# Altium schematic sheet Choin_led1_0.SchDoc
size A4; DocumentNumber: 2; SheetNumber: 2; SheetTotal: 4; LotOfPieces: 1
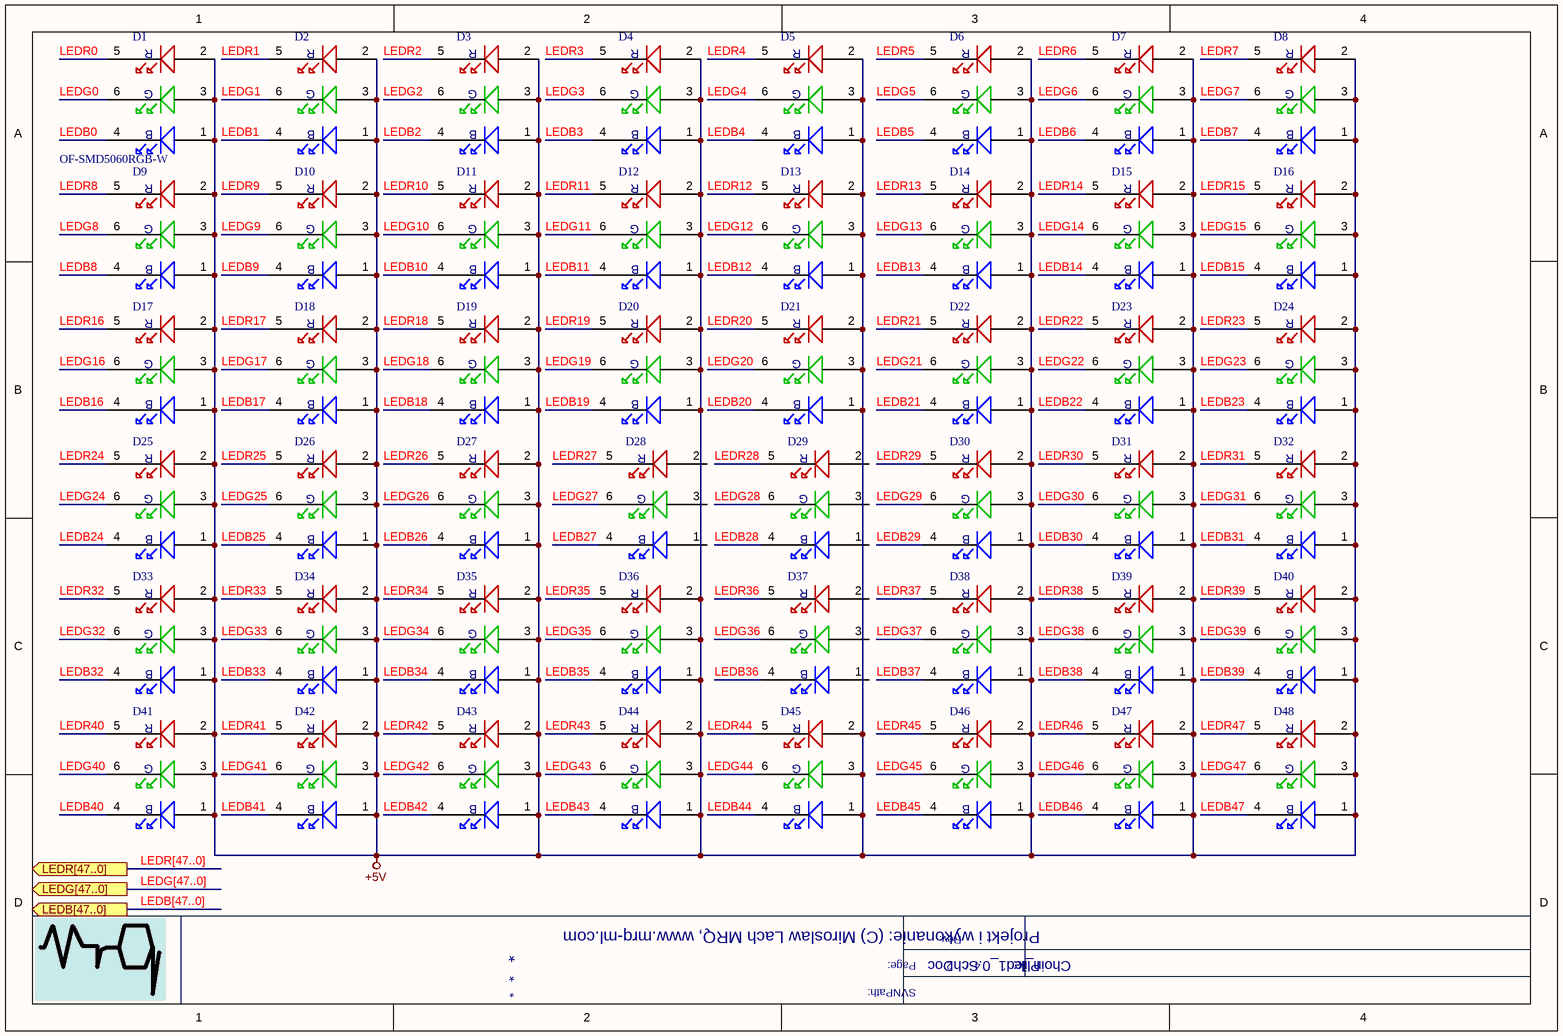
[diagram p0: Choin_led1_0.SchDoc]

## Parts
D1  OF-SMD5060RGB-W  [OF-SMD5060RGB-W]
D2  OF-SMD5060RGB-W  [OF-SMD5060RGB-W]  (value not drawn)
D3  OF-SMD5060RGB-W  [OF-SMD5060RGB-W]  (value not drawn)
D4  OF-SMD5060RGB-W  [OF-SMD5060RGB-W]  (value not drawn)
D5  OF-SMD5060RGB-W  [OF-SMD5060RGB-W]  (value not drawn)
D6  OF-SMD5060RGB-W  [OF-SMD5060RGB-W]  (value not drawn)
D7  OF-SMD5060RGB-W  [OF-SMD5060RGB-W]  (value not drawn)
D8  OF-SMD5060RGB-W  [OF-SMD5060RGB-W]  (value not drawn)
D9  OF-SMD5060RGB-W  [OF-SMD5060RGB-W]  (value not drawn)
D10  OF-SMD5060RGB-W  [OF-SMD5060RGB-W]  (value not drawn)
D11  OF-SMD5060RGB-W  [OF-SMD5060RGB-W]  (value not drawn)
D12  OF-SMD5060RGB-W  [OF-SMD5060RGB-W]  (value not drawn)
D13  OF-SMD5060RGB-W  [OF-SMD5060RGB-W]  (value not drawn)
D14  OF-SMD5060RGB-W  [OF-SMD5060RGB-W]  (value not drawn)
D15  OF-SMD5060RGB-W  [OF-SMD5060RGB-W]  (value not drawn)
D16  OF-SMD5060RGB-W  [OF-SMD5060RGB-W]  (value not drawn)
D17  OF-SMD5060RGB-W  [OF-SMD5060RGB-W]  (value not drawn)
D18  OF-SMD5060RGB-W  [OF-SMD5060RGB-W]  (value not drawn)
D19  OF-SMD5060RGB-W  [OF-SMD5060RGB-W]  (value not drawn)
D20  OF-SMD5060RGB-W  [OF-SMD5060RGB-W]  (value not drawn)
D21  OF-SMD5060RGB-W  [OF-SMD5060RGB-W]  (value not drawn)
D22  OF-SMD5060RGB-W  [OF-SMD5060RGB-W]  (value not drawn)
D23  OF-SMD5060RGB-W  [OF-SMD5060RGB-W]  (value not drawn)
D24  OF-SMD5060RGB-W  [OF-SMD5060RGB-W]  (value not drawn)
D25  OF-SMD5060RGB-W  [OF-SMD5060RGB-W]  (value not drawn)
D26  OF-SMD5060RGB-W  [OF-SMD5060RGB-W]  (value not drawn)
D27  OF-SMD5060RGB-W  [OF-SMD5060RGB-W]  (value not drawn)
D28  OF-SMD5060RGB-W  [OF-SMD5060RGB-W]  (value not drawn)
D29  OF-SMD5060RGB-W  [OF-SMD5060RGB-W]  (value not drawn)
D30  OF-SMD5060RGB-W  [OF-SMD5060RGB-W]  (value not drawn)
D31  OF-SMD5060RGB-W  [OF-SMD5060RGB-W]  (value not drawn)
D32  OF-SMD5060RGB-W  [OF-SMD5060RGB-W]  (value not drawn)
D33  OF-SMD5060RGB-W  [OF-SMD5060RGB-W]  (value not drawn)
D34  OF-SMD5060RGB-W  [OF-SMD5060RGB-W]  (value not drawn)
D35  OF-SMD5060RGB-W  [OF-SMD5060RGB-W]  (value not drawn)
D36  OF-SMD5060RGB-W  [OF-SMD5060RGB-W]  (value not drawn)
D37  OF-SMD5060RGB-W  [OF-SMD5060RGB-W]  (value not drawn)
D38  OF-SMD5060RGB-W  [OF-SMD5060RGB-W]  (value not drawn)
D39  OF-SMD5060RGB-W  [OF-SMD5060RGB-W]  (value not drawn)
D40  OF-SMD5060RGB-W  [OF-SMD5060RGB-W]  (value not drawn)
D41  OF-SMD5060RGB-W  [OF-SMD5060RGB-W]  (value not drawn)
D42  OF-SMD5060RGB-W  [OF-SMD5060RGB-W]  (value not drawn)
D43  OF-SMD5060RGB-W  [OF-SMD5060RGB-W]  (value not drawn)
D44  OF-SMD5060RGB-W  [OF-SMD5060RGB-W]  (value not drawn)
D45  OF-SMD5060RGB-W  [OF-SMD5060RGB-W]  (value not drawn)
D46  OF-SMD5060RGB-W  [OF-SMD5060RGB-W]  (value not drawn)
D47  OF-SMD5060RGB-W  [OF-SMD5060RGB-W]  (value not drawn)
D48  OF-SMD5060RGB-W  [OF-SMD5060RGB-W]  (value not drawn)

## Ports
LEDB[47..0], LEDG[47..0], LEDR[47..0]

## Nets
+5V: D1.1(ANOD) D1.2(ANOD) D1.3(ANOD) D2.1(ANOD) D2.2(ANOD) D2.3(ANOD) D3.1(ANOD) D3.2(ANOD) D3.3(ANOD) D4.1(ANOD) D4.2(ANOD) D4.3(ANOD) D5.1(ANOD) D5.2(ANOD) D5.3(ANOD) D6.1(ANOD) D6.2(ANOD) D6.3(ANOD) D7.1(ANOD) D7.2(ANOD) D7.3(ANOD) D8.1(ANOD) D8.2(ANOD) D8.3(ANOD) D9.1(ANOD) D9.2(ANOD) D9.3(ANOD) D10.1(ANOD) D10.2(ANOD) D10.3(ANOD) D11.1(ANOD) D11.2(ANOD) D11.3(ANOD) D12.1(ANOD) D12.2(ANOD) D12.3(ANOD) D13.1(ANOD) D13.2(ANOD) D13.3(ANOD) D14.1(ANOD) D14.2(ANOD) D14.3(ANOD) D15.1(ANOD) D15.2(ANOD) D15.3(ANOD) D16.1(ANOD) D16.2(ANOD) D16.3(ANOD) D17.1(ANOD) D17.2(ANOD) D17.3(ANOD) D18.1(ANOD) D18.2(ANOD) D18.3(ANOD) D19.1(ANOD) D19.2(ANOD) D19.3(ANOD) D20.1(ANOD) D20.2(ANOD) D20.3(ANOD) D21.1(ANOD) D21.2(ANOD) D21.3(ANOD) D22.1(ANOD) D22.2(ANOD) D22.3(ANOD) D23.1(ANOD) D23.2(ANOD) D23.3(ANOD) D24.1(ANOD) D24.2(ANOD) D24.3(ANOD) D25.1(ANOD) D25.2(ANOD) D25.3(ANOD) D26.1(ANOD) D26.2(ANOD) D26.3(ANOD) D27.1(ANOD) D27.2(ANOD) D27.3(ANOD) D30.1(ANOD) D30.2(ANOD) D30.3(ANOD) D31.1(ANOD) D31.2(ANOD) D31.3(ANOD) D32.1(ANOD) D32.2(ANOD) D32.3(ANOD) D33.1(ANOD) D33.2(ANOD) D33.3(ANOD) D34.1(ANOD) D34.2(ANOD) D34.3(ANOD) D35.1(ANOD) D35.2(ANOD) D35.3(ANOD) D36.1(ANOD) D36.2(ANOD) D36.3(ANOD) D38.1(ANOD) D38.2(ANOD) D38.3(ANOD) D39.1(ANOD) D39.2(ANOD) D39.3(ANOD) D40.1(ANOD) D40.2(ANOD) D40.3(ANOD) D41.1(ANOD) D41.2(ANOD) D41.3(ANOD) D42.1(ANOD) D42.2(ANOD) D42.3(ANOD) D43.1(ANOD) D43.2(ANOD) D43.3(ANOD) D44.1(ANOD) D44.2(ANOD) D44.3(ANOD) D45.1(ANOD) D45.2(ANOD) D45.3(ANOD) D46.1(ANOD) D46.2(ANOD) D46.3(ANOD) D47.1(ANOD) D47.2(ANOD) D47.3(ANOD) D48.1(ANOD) D48.2(ANOD) D48.3(ANOD)
LEDB0: D1.4(CATH)
LEDB1: D2.4(CATH)
LEDB2: D3.4(CATH)
LEDB3: D4.4(CATH)
LEDB4: D5.4(CATH)
LEDB5: D6.4(CATH)
LEDB6: D7.4(CATH)
LEDB7: D8.4(CATH)
LEDB8: D9.4(CATH)
LEDB9: D10.4(CATH)
LEDB10: D11.4(CATH)
LEDB11: D12.4(CATH)
LEDB12: D13.4(CATH)
LEDB13: D14.4(CATH)
LEDB14: D15.4(CATH)
LEDB15: D16.4(CATH)
LEDB16: D17.4(CATH)
LEDB17: D18.4(CATH)
LEDB18: D19.4(CATH)
LEDB19: D20.4(CATH)
LEDB20: D21.4(CATH)
LEDB21: D22.4(CATH)
LEDB22: D23.4(CATH)
LEDB23: D24.4(CATH)
LEDB24: D25.4(CATH)
LEDB25: D26.4(CATH)
LEDB26: D27.4(CATH)
LEDB27: D28.4(CATH)
LEDB28: D29.4(CATH)
LEDB29: D30.4(CATH)
LEDB30: D31.4(CATH)
LEDB31: D32.4(CATH)
LEDB32: D33.4(CATH)
LEDB33: D34.4(CATH)
LEDB34: D35.4(CATH)
LEDB35: D36.4(CATH)
LEDB36: D37.4(CATH)
LEDB37: D38.4(CATH)
LEDB38: D39.4(CATH)
LEDB39: D40.4(CATH)
LEDB40: D41.4(CATH)
LEDB41: D42.4(CATH)
LEDB42: D43.4(CATH)
LEDB43: D44.4(CATH)
LEDB44: D45.4(CATH)
LEDB45: D46.4(CATH)
LEDB46: D47.4(CATH)
LEDB47: D48.4(CATH)
LEDG0: D1.6(CATH)
LEDG1: D2.6(CATH)
LEDG2: D3.6(CATH)
LEDG3: D4.6(CATH)
LEDG4: D5.6(CATH)
LEDG5: D6.6(CATH)
LEDG6: D7.6(CATH)
LEDG7: D8.6(CATH)
LEDG8: D9.6(CATH)
LEDG9: D10.6(CATH)
LEDG10: D11.6(CATH)
LEDG11: D12.6(CATH)
LEDG12: D13.6(CATH)
LEDG13: D14.6(CATH)
LEDG14: D15.6(CATH)
LEDG15: D16.6(CATH)
LEDG16: D17.6(CATH)
LEDG17: D18.6(CATH)
LEDG18: D19.6(CATH)
LEDG19: D20.6(CATH)
LEDG20: D21.6(CATH)
LEDG21: D22.6(CATH)
LEDG22: D23.6(CATH)
LEDG23: D24.6(CATH)
LEDG24: D25.6(CATH)
LEDG25: D26.6(CATH)
LEDG26: D27.6(CATH)
LEDG27: D28.6(CATH)
LEDG28: D29.6(CATH)
LEDG29: D30.6(CATH)
LEDG30: D31.6(CATH)
LEDG31: D32.6(CATH)
LEDG32: D33.6(CATH)
LEDG33: D34.6(CATH)
LEDG34: D35.6(CATH)
LEDG35: D36.6(CATH)
LEDG36: D37.6(CATH)
LEDG37: D38.6(CATH)
LEDG38: D39.6(CATH)
LEDG39: D40.6(CATH)
LEDG40: D41.6(CATH)
LEDG41: D42.6(CATH)
LEDG42: D43.6(CATH)
LEDG43: D44.6(CATH)
LEDG44: D45.6(CATH)
LEDG45: D46.6(CATH)
LEDG46: D47.6(CATH)
LEDG47: D48.6(CATH)
LEDR0: D1.5(CATH)
LEDR1: D2.5(CATH)
LEDR2: D3.5(CATH)
LEDR3: D4.5(CATH)
LEDR4: D5.5(CATH)
LEDR5: D6.5(CATH)
LEDR6: D7.5(CATH)
LEDR7: D8.5(CATH)
LEDR8: D9.5(CATH)
LEDR9: D10.5(CATH)
LEDR10: D11.5(CATH)
LEDR11: D12.5(CATH)
LEDR12: D13.5(CATH)
LEDR13: D14.5(CATH)
LEDR14: D15.5(CATH)
LEDR15: D16.5(CATH)
LEDR16: D17.5(CATH)
LEDR17: D18.5(CATH)
LEDR18: D19.5(CATH)
LEDR19: D20.5(CATH)
LEDR20: D21.5(CATH)
LEDR21: D22.5(CATH)
LEDR22: D23.5(CATH)
LEDR23: D24.5(CATH)
LEDR24: D25.5(CATH)
LEDR25: D26.5(CATH)
LEDR26: D27.5(CATH)
LEDR27: D28.5(CATH)
LEDR28: D29.5(CATH)
LEDR29: D30.5(CATH)
LEDR30: D31.5(CATH)
LEDR31: D32.5(CATH)
LEDR32: D33.5(CATH)
LEDR33: D34.5(CATH)
LEDR34: D35.5(CATH)
LEDR35: D36.5(CATH)
LEDR36: D37.5(CATH)
LEDR37: D38.5(CATH)
LEDR38: D39.5(CATH)
LEDR39: D40.5(CATH)
LEDR40: D41.5(CATH)
LEDR41: D42.5(CATH)
LEDR42: D43.5(CATH)
LEDR43: D44.5(CATH)
LEDR44: D45.5(CATH)
LEDR45: D46.5(CATH)
LEDR46: D47.5(CATH)
LEDR47: D48.5(CATH)

Not connected (* = marked no-connect by the designer): D28 1(ANOD) 2(ANOD) 3(ANOD); D29 1(ANOD) 2(ANOD) 3(ANOD); D37 1(ANOD) 2(ANOD) 3(ANOD)

## Buses and harness runs
bus LEDB[47..0] = port LEDB[47..0]
bus LEDG[47..0] = port LEDG[47..0]
bus LEDR[47..0] = port LEDR[47..0]

## Notes on the sheet
- Projekt i wykonanie: (C) Miroslaw Lach MRQ, www.mrq-ml.com
- SVNPath:
- Page:
- Rev.
- /
- Plik:
- (in symbol OF-SMD5060RGB-W[[/\]]5060) R; G; B

## Library data of the parts
D1-D48 = OF-SMD5060RGB-W[[/\]]5060: Descript: 5050 Single Chip RGB Color Top LED; Currency5: PLN; Amount5: 100+; Value: OF-SMD5060RGB-W; Dimensions: 5060; ComponentLink1Description: Datasheet; ComponentLink1URL: ftp://s2.zenbox.pl:2121/opto/OF-SMD5060RGB-W.pdf; Supplier5: tme.pl; Reference5: OF-SMD5060RGB-W; Manufacturer5: Optoflash; Typ5: OF-SMD5060RGB-W; Price5: 1,3206; DateOfPrice5: 2014-01-04